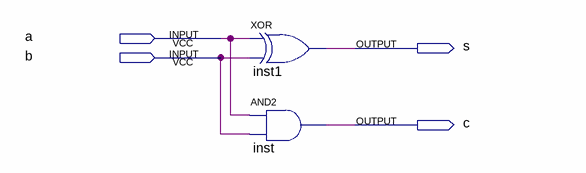
[diagram p0: schematic sheet]
// Quartus schematic myAddHalf.bdf as structural Verilog: 2 symbols, 4 pins
module myAddHalf (
  input  a,
  input  b,
  output s,
  output c
);

  xor inst1 (s, a, b);
  and inst (c, a, b);
endmodule
